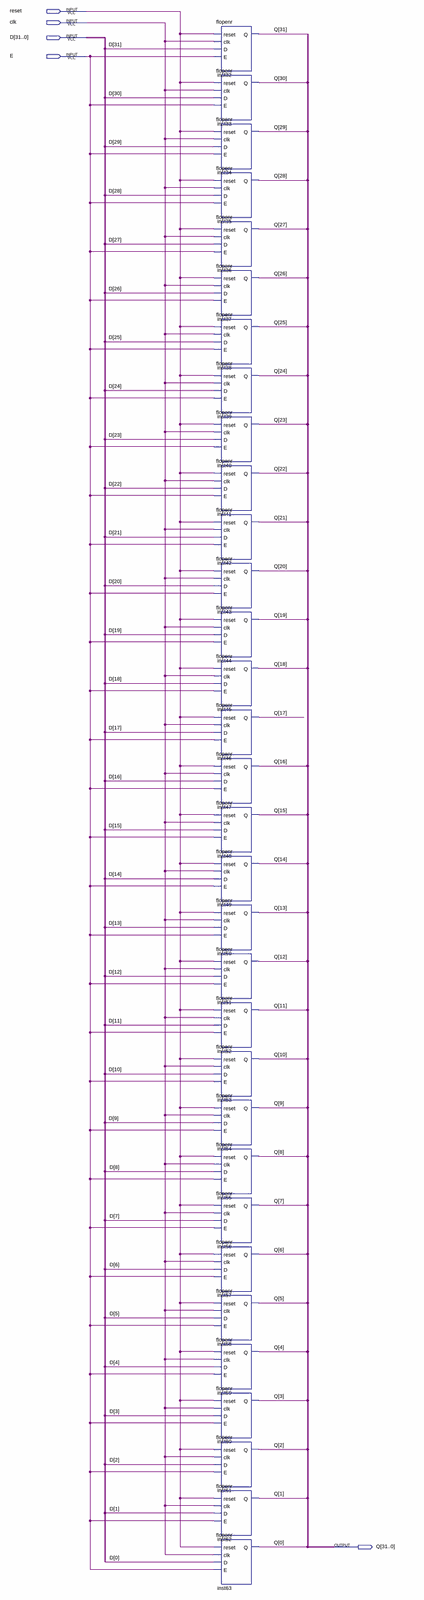
[diagram p0: schematic sheet, whole]
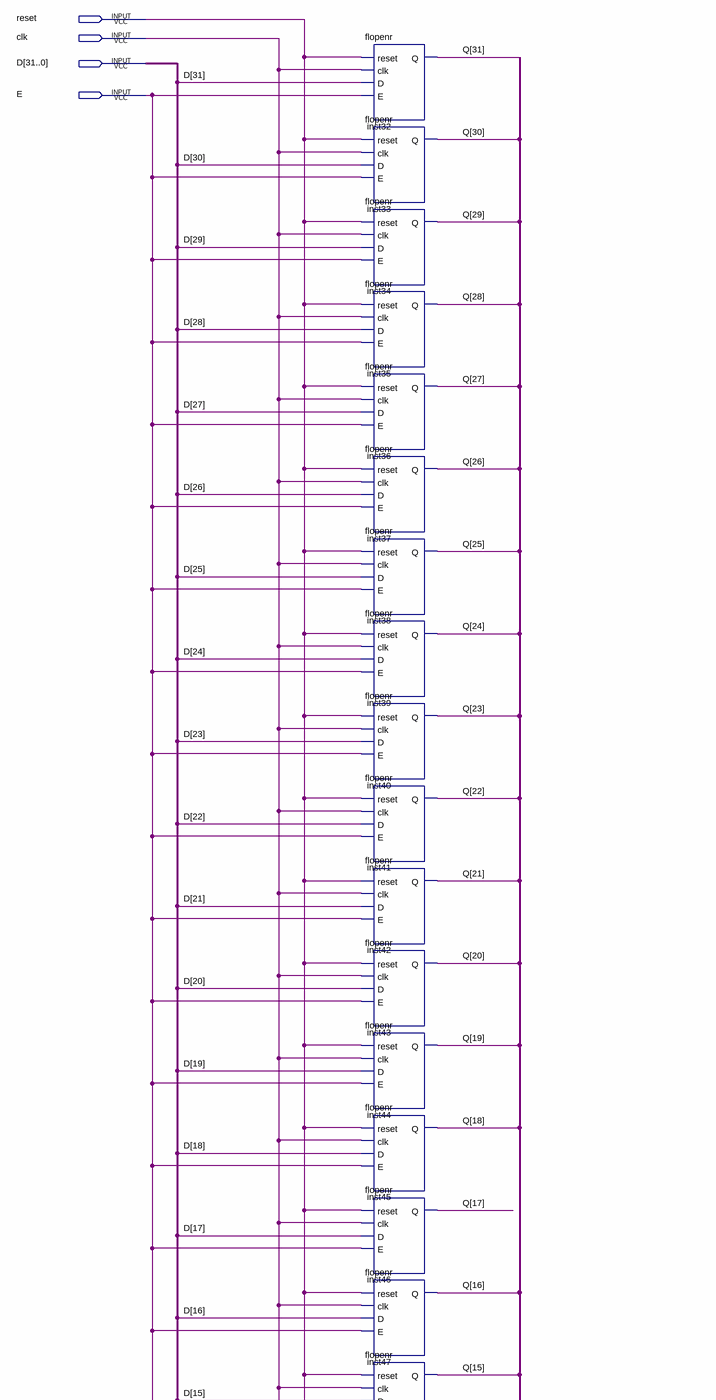
[diagram p1: schematic sheet, upper part]
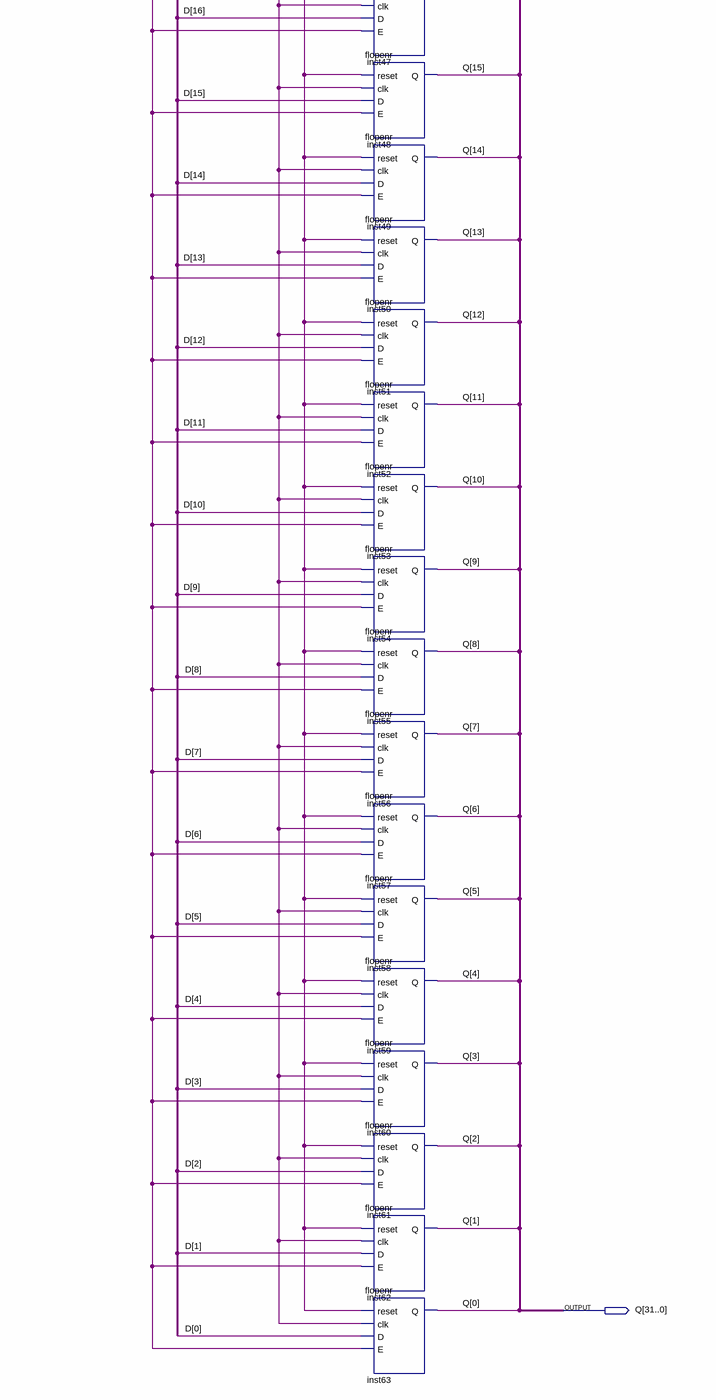
[diagram p2: schematic sheet, lower part]
// Quartus schematic flopenr_32.bdf as structural Verilog: 32 symbols, 5 pins
module flopenr_32 (
  input  reset,
  input  clk,
  input  [31:0] D,
  input  E,
  output [31:0] Q
);

  flopenr inst32 (.reset(reset), .clk(clk), .D(D[31]), .E(E), .Q(Q[31]));
  flopenr inst33 (.reset(reset), .clk(clk), .D(D[30]), .E(E), .Q(Q[30]));
  flopenr inst34 (.reset(reset), .clk(clk), .D(D[29]), .E(E), .Q(Q[29]));
  flopenr inst35 (.reset(reset), .clk(clk), .D(D[28]), .E(E), .Q(Q[28]));
  flopenr inst36 (.reset(reset), .clk(clk), .D(D[27]), .E(E), .Q(Q[27]));
  flopenr inst37 (.reset(reset), .clk(clk), .D(D[26]), .E(E), .Q(Q[26]));
  flopenr inst38 (.reset(reset), .clk(clk), .D(D[25]), .E(E), .Q(Q[25]));
  flopenr inst39 (.reset(reset), .clk(clk), .D(D[24]), .E(E), .Q(Q[24]));
  flopenr inst40 (.reset(reset), .clk(clk), .D(D[23]), .E(E), .Q(Q[23]));
  flopenr inst41 (.reset(reset), .clk(clk), .D(D[22]), .E(E), .Q(Q[22]));
  flopenr inst42 (.reset(reset), .clk(clk), .D(D[21]), .E(E), .Q(Q[21]));
  flopenr inst43 (.reset(reset), .clk(clk), .D(D[20]), .E(E), .Q(Q[20]));
  flopenr inst44 (.reset(reset), .clk(clk), .D(D[19]), .E(E), .Q(Q[19]));
  flopenr inst45 (.reset(reset), .clk(clk), .D(D[18]), .E(E), .Q(Q[18]));
  flopenr inst46 (.reset(reset), .clk(clk), .D(D[17]), .E(E), .Q(Q[17]));
  flopenr inst47 (.reset(reset), .clk(clk), .D(D[16]), .E(E), .Q(Q[16]));
  flopenr inst48 (.reset(reset), .clk(clk), .D(D[15]), .E(E), .Q(Q[15]));
  flopenr inst49 (.reset(reset), .clk(clk), .D(D[14]), .E(E), .Q(Q[14]));
  flopenr inst50 (.reset(reset), .clk(clk), .D(D[13]), .E(E), .Q(Q[13]));
  flopenr inst51 (.reset(reset), .clk(clk), .D(D[12]), .E(E), .Q(Q[12]));
  flopenr inst52 (.reset(reset), .clk(clk), .D(D[11]), .E(E), .Q(Q[11]));
  flopenr inst53 (.reset(reset), .clk(clk), .D(D[10]), .E(E), .Q(Q[10]));
  flopenr inst54 (.reset(reset), .clk(clk), .D(D[9]), .E(E), .Q(Q[9]));
  flopenr inst55 (.reset(reset), .clk(clk), .D(D[8]), .E(E), .Q(Q[8]));
  flopenr inst56 (.reset(reset), .clk(clk), .D(D[7]), .E(E), .Q(Q[7]));
  flopenr inst57 (.reset(reset), .clk(clk), .D(D[6]), .E(E), .Q(Q[6]));
  flopenr inst58 (.reset(reset), .clk(clk), .D(D[5]), .E(E), .Q(Q[5]));
  flopenr inst59 (.reset(reset), .clk(clk), .D(D[4]), .E(E), .Q(Q[4]));
  flopenr inst60 (.reset(reset), .clk(clk), .D(D[3]), .E(E), .Q(Q[3]));
  flopenr inst61 (.reset(reset), .clk(clk), .D(D[2]), .E(E), .Q(Q[2]));
  flopenr inst62 (.reset(reset), .clk(clk), .D(D[1]), .E(E), .Q(Q[1]));
  flopenr inst63 (.reset(reset), .clk(clk), .D(D[0]), .E(E), .Q(Q[0]));
endmodule
